# EAGLE design pjvs_mux_v1 (EAGLE 6.5.0)
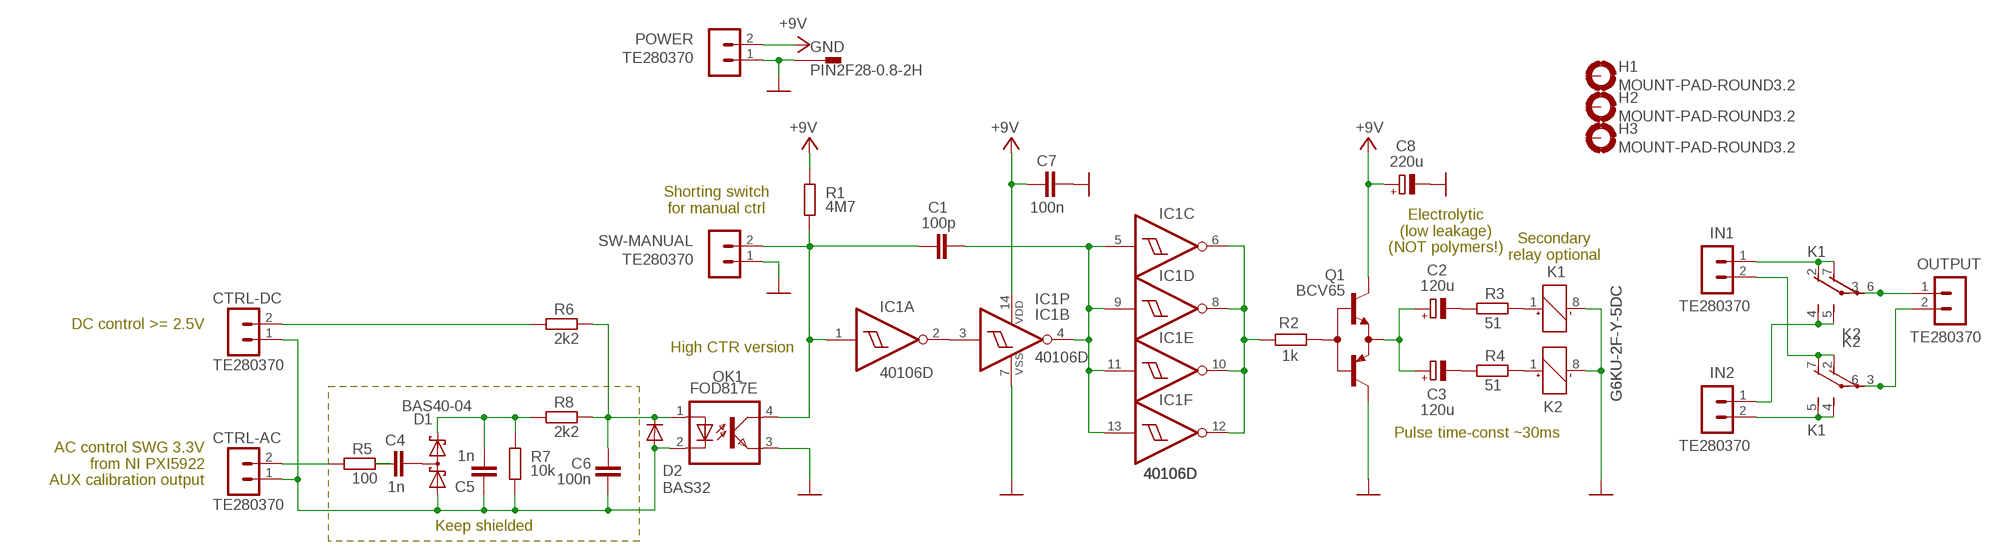
[diagram p0: schematic, sheet 1]

## Parts
C1  100p  C-EU025-024X044  [C025-024X044]
C2  120u  CPOL-EUE2.5-7  [E2,5-7]
C3  120u  CPOL-EUE2.5-7  [E2,5-7]
C4  1n  C-EUC0805K  [C0805K]
C5  1n  C-EUC0805K  [C0805K]
C6  100n  C-EUC0805K  [C0805K]
C7  100n  C-EUC0805K  [C0805K]
C8  220u  CPOL-EUE3.5-8  [E3,5-8]
CTRL-AC  TE280370  [TE280370]
CTRL-DC  TE280370  [TE280370]
D1  BAS40-04  [SOT23]
D2  BAS32  [SOD80C]
GND  PIN2F28-0.8-2H  [F28-0.8-2H]
H1  MOUNT-PAD-ROUND3.2  [3,2-PAD]
H2  MOUNT-PAD-ROUND3.2  [3,2-PAD]
H3  MOUNT-PAD-ROUND3.2  [3,2-PAD]
IC1  40106D  [SO14]
IN1  TE280370  [TE280370]
IN2  TE280370  [TE280370]
K1  G6KU-2F-Y-5DC  G6KU-2F-Y  [G6KU-2F-Y]
K2  G6KU-2F-Y-5DC  G6KU-2F-Y  [G6KU-2F-Y]
OK1  FOD817E  PC817  [DIL04]
OUTPUT  TE280370  [TE280370]
POWER  TE280370  [TE280370]
Q1  BCV65  BCV62  [SOT143]
R1  4M7  R-EU_0207/2V  [0207/2V]
R2  1k  R-EU_R0805  [R0805]
R3  51  R-EU_R0805  [R0805]
R4  51  R-EU_R0805  [R0805]
R5  100  R-EU_R0805  [R0805]
R6  2k2  R-EU_R0805  [R0805]
R7  10k  R-EU_R0805  [R0805]
R8  2k2  R-EU_R0805  [R0805]
SW-MANUAL  TE280370  [TE280370]

## Nets
+9V: C7.1 C8.+ IC1.14(P:VDD) POWER.2 Q1.1(C1) R1.2
GND: C7.2 C8.- GND.P$1 GND.P$2 IC1.7(P:VSS) K1.8(1:-) K2.8(1:-) OK1.3(EMIT) POWER.1 Q1.3(C2) SW-MANUAL.1
N$1: IC1.2(A:O) IC1.3(B:I)
N$2: C1.2 IC1.4(B:O) IC1.5(C:I) IC1.9(D:I) IC1.11(E:I) IC1.13(F:I)
N$3: C1.1 IC1.1(A:I) OK1.4(COL) R1.1 SW-MANUAL.2
N$4: IC1.6(C:O) IC1.8(D:O) IC1.10(E:O) IC1.12(F:O) R2.2
N$5: Q1.2(B) R2.1
N$6: IN2.1 K1.4(2:S) K2.5(3:S)
N$7: C2.- R3.1
N$8: K1.1(1:+) R3.2
N$9: C2.+ C3.+ Q1.4(E)
N$10: C3.- R4.1
N$11: K2.1(1:+) R4.2
N$12: IN1.1 K1.2(2:O) K2.7(3:O)
N$13: K1.3(2:P) K2.6(3:P) OUTPUT.1
N$14: IN2.2 K1.5(3:S) K2.4(2:S)
N$15: IN1.2 K1.7(3:O) K2.2(2:O)
N$16: K1.6(3:P) K2.3(2:P) OUTPUT.2
N$17: C4.1 R5.2
N$18: CTRL-AC.2 R5.1
N$19: C4.2 D1.3(C1A2)
N$20: C5.1 C6.1 CTRL-AC.1 CTRL-DC.1 D1.1(A1) D2.A OK1.2(C) R7.1
N$21: C5.2 D1.2(C2) R7.2 R8.1
N$23: C6.2 D2.C OK1.1(A) R6.2 R8.2
N$24: CTRL-DC.2 R6.1
Unconnected: H1.B3,2(MOUNT) H2.B3,2(MOUNT) H3.B3,2(MOUNT)

## Notes on the sheet
- Shorting switch
  for manual ctrl
- Electrolytic
  (low leakage)
  (NOT polymers!)
- Secondary
  relay optional
- DC control >= 2.5V
- High CTR version
- Pulse time-const ~30ms
- AC control SWG 3.3V
  from NI PXI5922
  AUX calibration output
- Keep shielded

## Library data of the parts
C1 C4-C7 = rcl:C-EU: CAPACITOR, European symbol
C2 C3 C8 = rcl:CPOL-EU: POLARIZED CAPACITOR, European symbol
CTRL-AC CTRL-DC IN1 IN2 OUTPUT POWER SW-MANUAL = piny:TE280370
D1 = diode:BAS40-04: Silicon Schottky Diodes General-purpose diode for high-speed switching
D2 = diode:BAS32: BAS32: High speed diode. trr = 4ns, Ur = 75V, If = 200mA.
GND = con-faston:PIN2: Flachstecker Typ Tyco/Electronics/AMP TAB, FASTON Printed Circuit Board Tabs Source: http://www.buerklin.com, http://catalog.tycoelectronics.com
H1-H3 = holes:MOUNT-PAD-ROUND: MOUNTING PAD, round
IC1 = 40xx:40106: Hex SCHMITT TRIGGER
K1 K2 = relay:G6K: Low Signal Relay oeiwcsnts1.omron.com/.. D20G6K0100.pdf; MF: OMRON COMPONENTS USA; MPN: G6KU-2F-Y DC3; OC_FARNELL: unknown; OC_NEWARK: 89C6496
OK1 = optocoupler:PC817: SHARP OPTO COUPLER; MPN: PC817X4J000F; OC_FARNELL: 9707727; OC_NEWARK: 97K7059
Q1 = transistor:BCV62
R1-R8 = rcl:R-EU_: RESISTOR, European symbol

## Net classes
0 default: clearance 0.305 mm

## Board
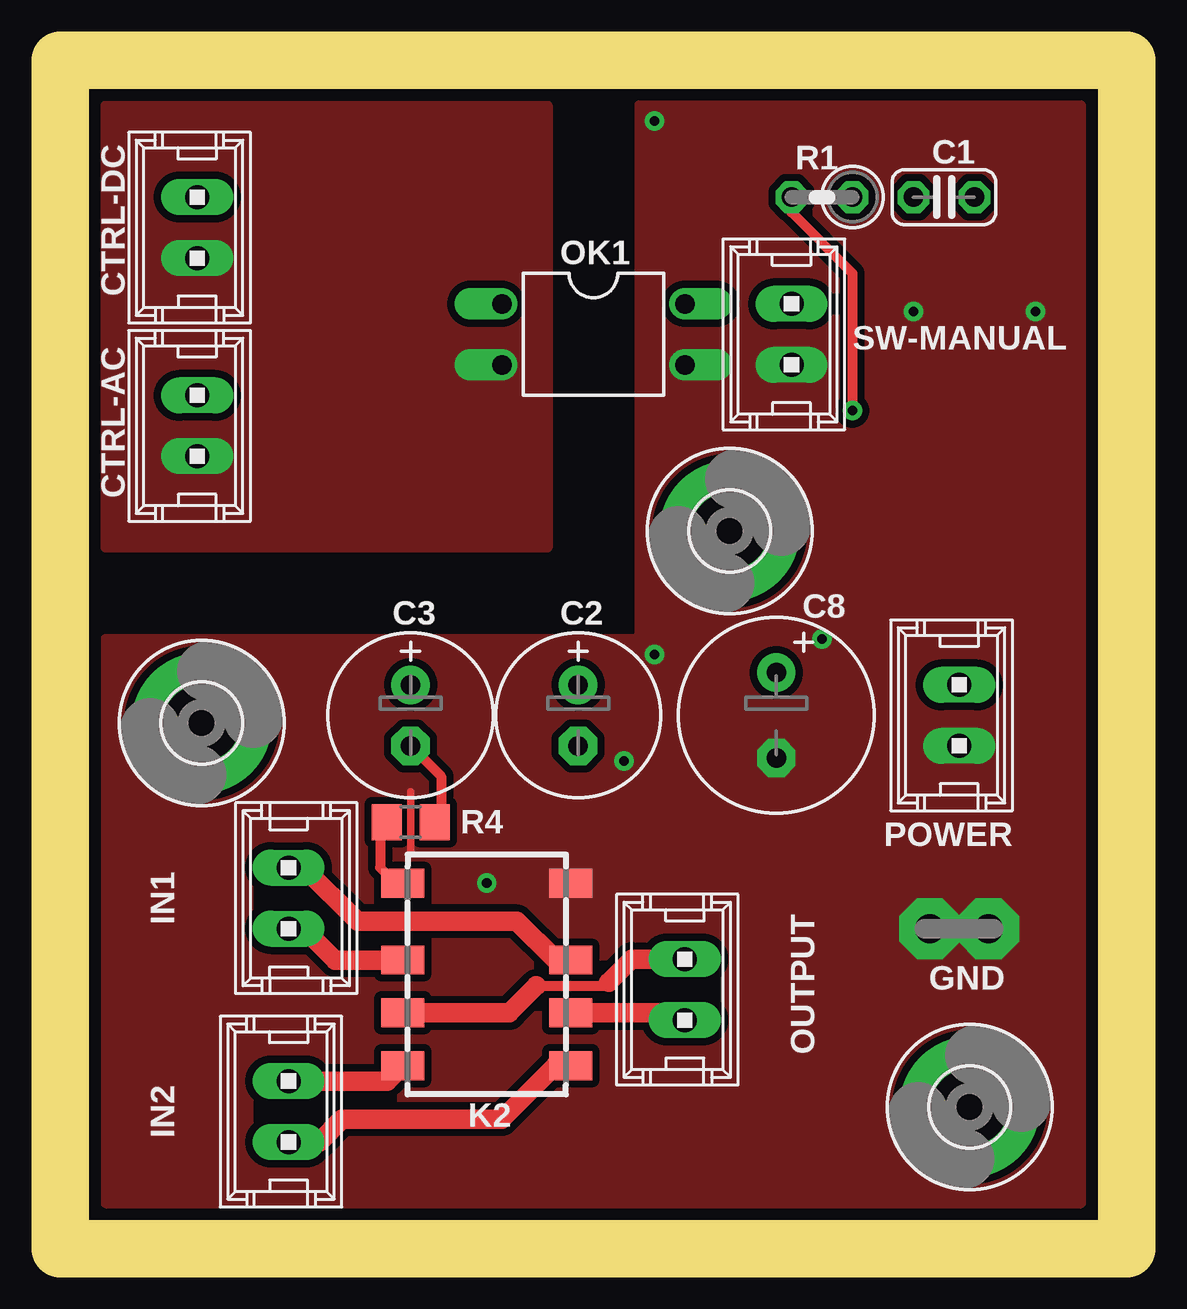
[diagram p1: board, top side]
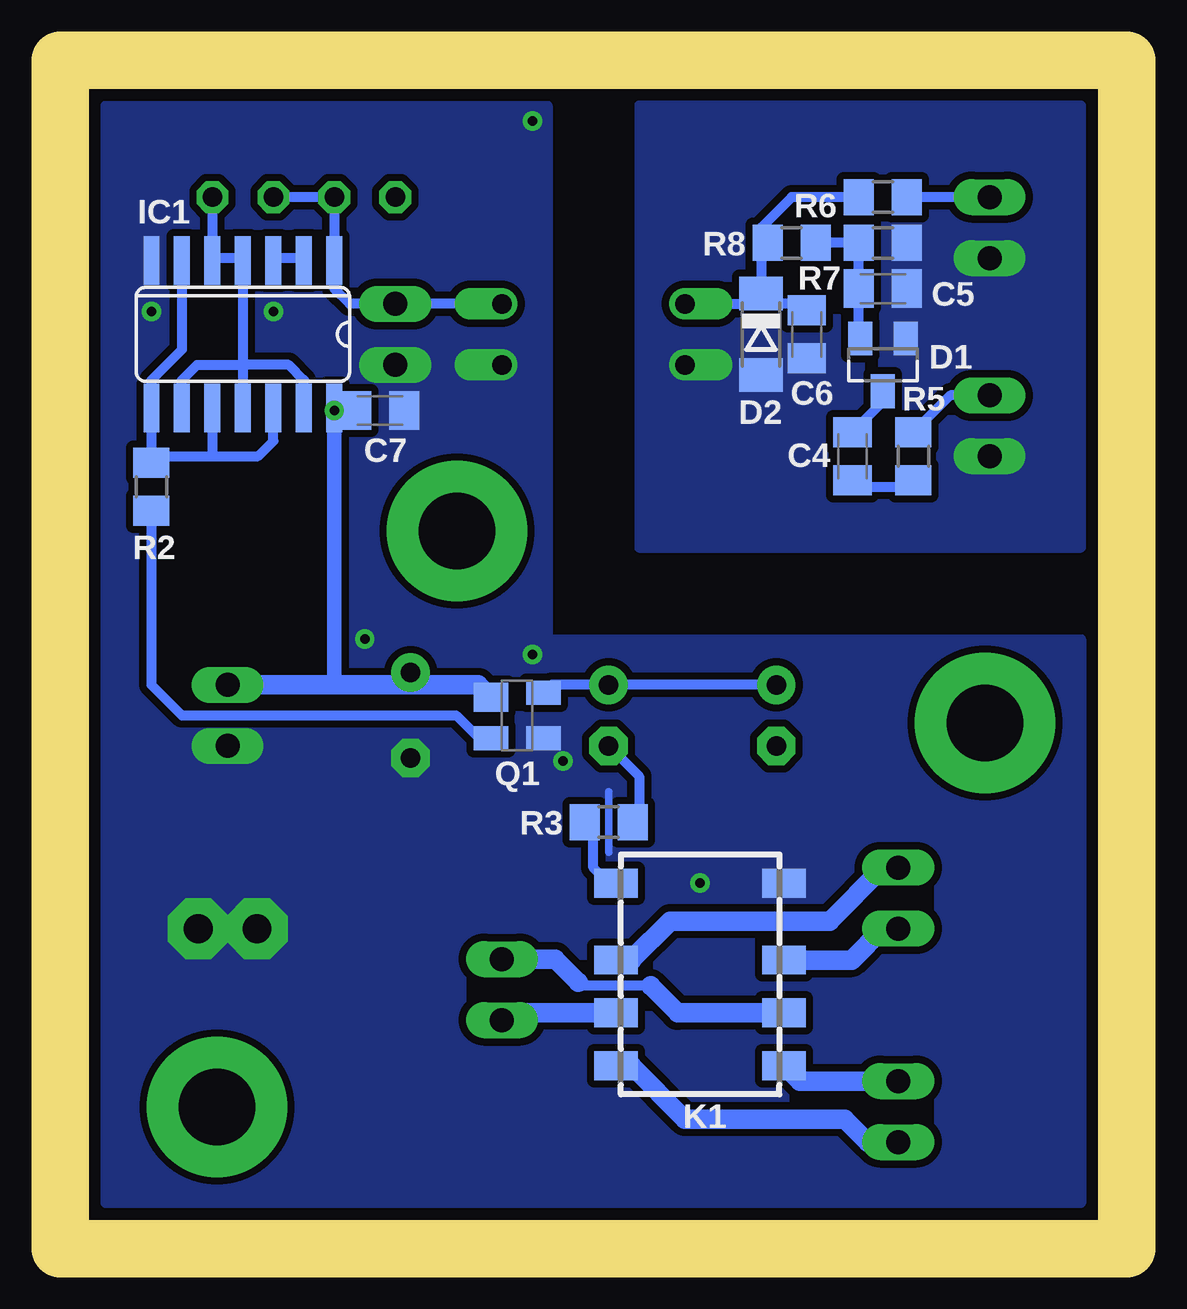
[diagram p2: board, bottom side, seen from below]

Size 44.45 x 49.53 mm. Coordinates in mm from the lower left corner, seen from the top.
Outline: 0,49.53 44.45,49.53 44.45,0 0,0 0,49.53
Copper layers (1*16): Top 0.035mm / dielectric 1.5mm / Bottom 0.035mm
Design rules "default *": minimum track width 10mil, minimum drill 24mil, track to track 8mil, track to pad 8mil, pad to pad 8mil, via to via 8mil, smd to smd 8mil, copper to edge 12mil, drill to drill 8mil, minimum pad ring 10mil, minimum via ring 8mil, stop-mask expansion 4mil, vias tented up to drill 0mil, thermal gap 10mil
tRestrict: 3 lines
bRestrict: 3 lines

### Footprints (pad centres in the part's own frame; a part is rotated, then mirrored left to right if it is on the bottom)
C025-024X044 = drill 0.813 octagon: 1 -1.27,0; 2 1.27,0
E2,5-7 = drill 0.813 pad 1.6: + -1.27,0 | drill 0.813 pad 1.6 octagon: - 1.27,0
C0805K = smd 1.25 x 1.6: 1 -1,0; 2 1,0
E3,5-8 = drill 0.813 pad 1.6: + -1.778,0 | drill 0.813 pad 1.6 octagon: - 1.778,0
TE280370 = drill 1 long: 1 0,0; 2 2.54,0
SOT23 = smd 1 x 1.4: 1 -0.95,-1.1; 2 0.95,-1.1; 3 0,1.1
SOD80C = smd 1.4 x 1.8: A 1.7,0; C -1.7,0
F28-0.8-2H = drill 1.2 pad 2.54 octagon: P$1 -1.225,0; P$2 1.225,0
3,2-PAD = drill 3.2 pad 5.842: B3,2 0,0
SO14 = smd 0.66 x 2.032: 1 -3.81,-3.073; 2 -2.54,-3.073; 3 -1.27,-3.073; 4 0,-3.073; 5 1.27,-3.073; 6 2.54,-3.073; 7 3.81,-3.073; 8 3.81,3.073; 9 2.54,3.073; 10 1.27,3.073; 11 0,3.073; 12 -1.27,3.073; 13 -2.54,3.073; 14 -3.81,3.073
G6KU-2F-Y = smd 1.2 x 1.8: 1 -3.8,-3.5; 2 -0.6,-3.5; 3 1.6,-3.5; 4 3.8,-3.5; 5 3.8,3.5; 6 1.6,3.5; 7 -0.6,3.5; 8 -3.8,3.5
DIL04 = drill 0.813 offset: 1 -1.27,-3.81; 2 1.27,-3.81; 3 1.27,3.81; 4 -1.27,3.81
SOT143 = smd 1.2 x 1.44: 1 -0.75,-1.1 | smd 1 x 1.44: 2 0.95,-1.1; 3 0.95,1.1; 4 -0.95,1.1
0207/2V = drill 0.813 octagon: 1 -1.27,0; 2 1.27,0
R0805 = smd 1.25 x 1.5: 1 -1,0; 2 1,0

### Placement (x,y rotation side)
C1  36.83,43.81 0 top
C2  21.59,22.23 270 top
C3  14.6,22.23 270 top
C4  11.43,33.02 90 bottom
C5  10.16,40.01 180 bottom
C6  13.33,38.1 90 bottom
C7  31.12,34.93 0 bottom
C8  29.85,22.23 270 top
CTRL-AC  5.71,33.02 90 top
CTRL-DC  5.71,41.27 90 top
D1  10.16,36.83 180 bottom
D2  15.24,38.1 270 bottom
GND  37.47,13.33 0 top
H1  5.91,21.91 0 top
H2  37.91,5.91 0 top
H3  27.91,29.91 0 top
IC1  36.83,38.1 180 bottom
IN1  9.53,15.88 270 top
IN2  9.53,4.45 90 top
K1  17.78,11.43 270 bottom
K2  17.78,11.43 270 top
OK1  22.23,38.1 270 top
OUTPUT  26.04,9.53 90 top
POWER  37.47,20.96 90 top
Q1  25.4,22.23 270 bottom
R1  31.75,43.81 180 top
R2  40.64,31.75 90 bottom
R3  21.59,17.78 180 bottom
R4  14.6,17.78 180 top
R5  8.89,33.02 270 bottom
R6  10.16,43.81 180 bottom
R7  10.16,41.91 180 bottom
R8  13.97,41.91 180 bottom
SW-MANUAL  30.48,36.83 90 top

### Tracks (layer width: path | path; a pad name or v marks a point on that pad's centre or on a via)
+9V  (via drill 0.4)
  Top 0.406: R1.2 30.48,43.18 33.02,40.64 v33.02,34.93
  Bottom 0.61: 33.02,23.5 v33.02,34.93 IC1.14 32.92,34.93 C7.1
  Bottom 0.813: POWER.2 33.02,23.5 29.85,23.5 | 29.85,23.5 27.02,23.5 Q1.1 | C8.+ 29.85,23.5
GND  (via drill 0.4)
  Top 0.305: 14.6,19.05 14.6,16.51
  Bottom 0.305: 21.59,19.05 21.59,16.51
  other vias: 23.5,20.32 17.78,15.24 31.75,25.4 24.77,24.77 24.77,46.99 40.64,39.05 35.56,39.05
  pour Bottom (rank 3, no thermals): 1.91,1.91 42.55,1.91 42.55,47.62 24.13,47.62 24.13,25.4 1.91,25.4
  pour Top (rank 3, no thermals): 1.91,1.91 42.55,1.91 42.55,47.62 24.13,47.62 24.13,25.4 1.91,25.4
N$1
  Bottom 0.406: IC1.2 34.29,41.27 35.46,41.27 IC1.3
N$2
  Bottom 0.406: C1.2 IC1.5 38,41.27 36.83,41.27 IC1.4 36.83,36.83 | 36.83,36.83 IC1.11 | IC1.13 34.29,36.2 34.93,36.83 36.83,36.83 | IC1.9 39.37,36.2 38.73,36.83 36.83,36.83
N$3
  Bottom 0.406: OK1.4 SW-MANUAL.2 32.38,39.37 33.02,40.01 IC1.1 R1.1 C1.1
N$4
  Bottom 0.406: IC1.12 35.56,33.66 36.2,33.02 38.1,33.02 | IC1.10 38.1,33.02 | 40.64,33.02 IC1.8 40.64,36.2 39.37,37.47 IC1.6 | 40.64,33.02 38.1,33.02 | R2.2 40.64,33.02
N$5
  Bottom 0.406: R2.1 40.64,23.5 39.37,22.23 27.94,22.23 26.99,21.28 Q1.2
N$6
  Top 0.813: K2.5 20.64,7.62 18.41,5.4 11.75,5.4 10.79,4.45 IN2.1
  Bottom 0.813: IN2.1 10.79,4.45 11.75,5.4 18.42,5.4 20.64,7.62 K2.5
N$7
  Bottom 0.406: C2.- 20.32,19.69 20.32,18.42 20.59,18.14 R3.1
N$8
  Bottom 0.406: K1.1 21.58,15.23 22.23,15.88 22.23,17.41 R3.2
N$9
  Bottom 0.406: C3.+ C2.+ 23.98,23.5 Q1.4
N$10
  Top 0.406: C3.- 15.88,19.69 15.88,18.42 15.6,18.14 R4.1
N$11
  Top 0.406: R4.2 13.33,17.78 13.33,15.88 13.97,15.24 14.27,15.24 K2.1
N$12
  Top 0.813: K2.7 20.67,12.03 20.64,12.06 19.04,13.64 12.4,13.64 10.16,15.88 IN1.1
  Bottom 0.813: IN1.1 10.16,15.88 12.38,13.65 19.02,13.65 20.64,12.06 20.64,12.03 K2.7
N$13
  Top 0.813: K2.6 25.73,9.83 OUTPUT.1
  Bottom 0.813: K2.6 25.73,9.83 OUTPUT.1
N$14
  Top 0.813: K2.4 13.63,6.99 IN2.2
  Bottom 0.813: IN2.2 13.63,6.99 K2.4
N$15
  Top 0.813: K2.2 11.46,12.03 10.16,13.33 IN1.2
  Bottom 0.813: K2.2 11.46,12.03 10.16,13.33 IN1.2
N$16
  Top 0.406: 19.84,10.95 22.7,10.95 22.86,11.11
  Top 0.813: K2.3 18.72,9.83 19.84,10.95 | 22.86,11.11 23.81,12.06 OUTPUT.2
  Bottom 0.406: 19.84,10.95 22.7,10.95 22.86,11.11
  Bottom 0.813: K2.3 18.72,9.83 19.84,10.95 | 22.86,11.11 23.81,12.06 OUTPUT.2
N$17
  Bottom 0.406: C4.1 11.43,31.75 9.16,31.75 R5.2
N$18
  Bottom 0.406: CTRL-AC.2 7.35,35.56 R5.1
N$19
  Bottom 0.406: D1.3 10.16,35.29 C4.2
N$20
  pour Bottom (no thermals): 1.91,47.62 20.32,47.62 20.32,29.21 1.91,29.21
  pour Top (no thermals): 1.91,47.62 20.32,47.62 20.32,29.21 1.91,29.21
N$21
  Bottom 0.406: D1.2 11.16,37.93 C5.2 R7.2 R8.1
N$23
  Bottom 0.406: R6.2 13.97,43.81 15.24,42.55 15.24,41.91 | 15.24,41.91 D2.C | R8.2 15.24,41.91 | C6.2 13.6,39.37 14.6,39.37 15.04,39.8 D2.C | OK1.1 15.24,39.37 D2.C
N$24
  Bottom 0.406: CTRL-DC.2 R6.1

### Text on the board
tDocu: DC | U>2.5V | GND | AC | U>3Vpkpk | GND | +9V | GND | POS | NEG | NEG | POS | NEG | POS | PJVS Short MUX / CMI, V1.0, 2025-08-14